# EAGLE design wendor motor (EAGLE 8.7.1)
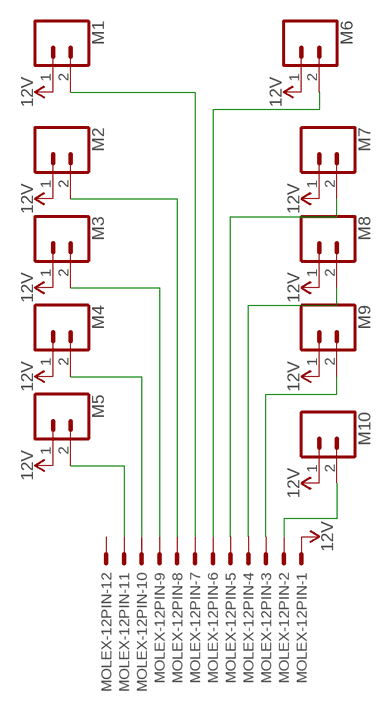
[diagram p0: schematic, sheet 1]

## Parts
M1  CONN_02  [1X02]
M2  CONN_02  [1X02]
M3  CONN_02  [1X02]
M4  CONN_02  [1X02]
M5  CONN_02  [1X02]
M6  CONN_02  [1X02]
M7  CONN_02  [1X02]
M8  CONN_02  [1X02]
M9  CONN_02  [1X02]
M10  CONN_02  [1X02]
MOLEX-12PIN  5566-12  [5566-12]

## Nets
12V: M1.1 M2.1 M3.1 M4.1 M5.1 M6.1 M7.1 M8.1 M9.1 M10.1 MOLEX-12PIN.1
N$1: M5.2 MOLEX-12PIN.11
N$2: M4.2 MOLEX-12PIN.10
N$3: M3.2 MOLEX-12PIN.9
N$4: M2.2 MOLEX-12PIN.8
N$5: M1.2 MOLEX-12PIN.7
N$6: M6.2 MOLEX-12PIN.6
N$7: M7.2 MOLEX-12PIN.5
N$8: M8.2 MOLEX-12PIN.4
N$9: M9.2 MOLEX-12PIN.3
N$10: M10.2 MOLEX-12PIN.2
Unconnected: MOLEX-12PIN.12

## Library data of the parts
M1-M10 = SparkFun-Connectors:CONN_02: Multi connection point. Often used as Generic Header-pin footprint for 0.1 inch spaced/style header connections On any of the 0.1 inch spaced packages, you can populate with these: Break Away Headers - Straight <https://www.sparkfun.com/products/116> (PRT-00116) Break Away Male Headers - Right Angle <https://www.sparkfun.com/products/553> (PRT-00553) Female Headers <https://www.sparkfun.com/products/115> (PRT-00115) Break Away Headers - Machine Pin <https://www.sparkfun.com/products/117> (PRT-00117) Break Away Female Headers - Swiss Machine Pin <https://www.sparkfun.com/products/743> (PRT-00743) For SCREWTERMINALS and SPRING TERMINALS visit here: Screw Terimnals on SparkFun.com <https://www.sparkfun.com/search/results?term=Screw+Terminals> (5mm/3.5mm/2.54mm spacing) This device is also useful as a general connection point to wire up your design to another part of your project. Our various solder wires solder well into these plated through hole pads. Hook-Up Wire - Assortment (Stranded, 22 AWG) <https://www.sparkfun.com/products/11375> (PRT-11375) Hook-Up Wire - Assortment (Solid Core, 22 AWG) <https://www.sparkfun.com/products/11367> (PRT-11367) View the entire wire category on our website here <https://www.sparkfun.com/categories/141> Special notes: Molex polarized connector foot print use with: PRT-08233 with associated crimp pins and housings. 2.54_SCREWTERM for use with PRT-10571. 3.5mm Screw Terminal footprints for PRT-08084 5mm Screw Terminal footprints for use with PRT-08432
MOLEX-12PIN = con-molex:5566-12: Mini FIT connector 12 pol Source: http://www.molex.com; MF: MOLEX; OC_FARNELL: unknown; OC_NEWARK: unknown

## Board
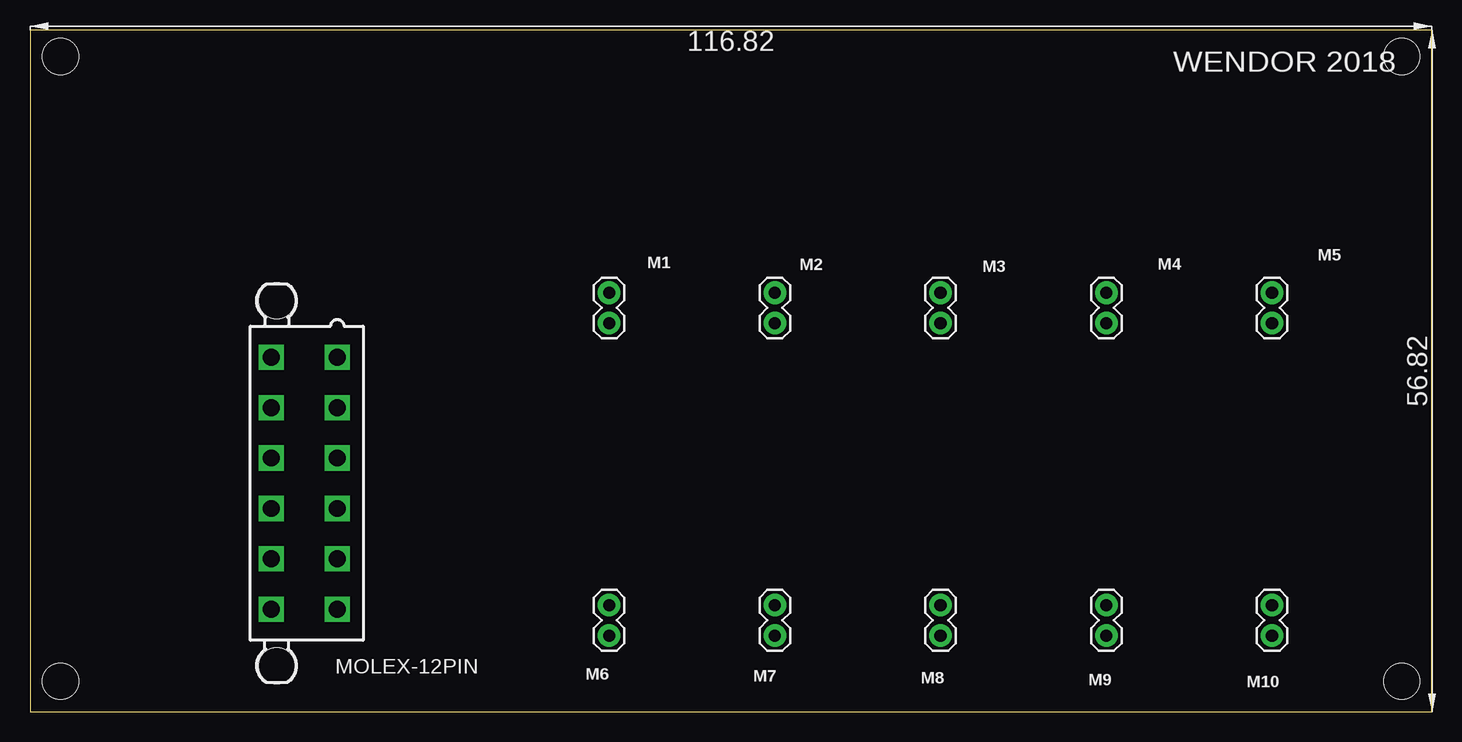
[diagram p1: board, top side]
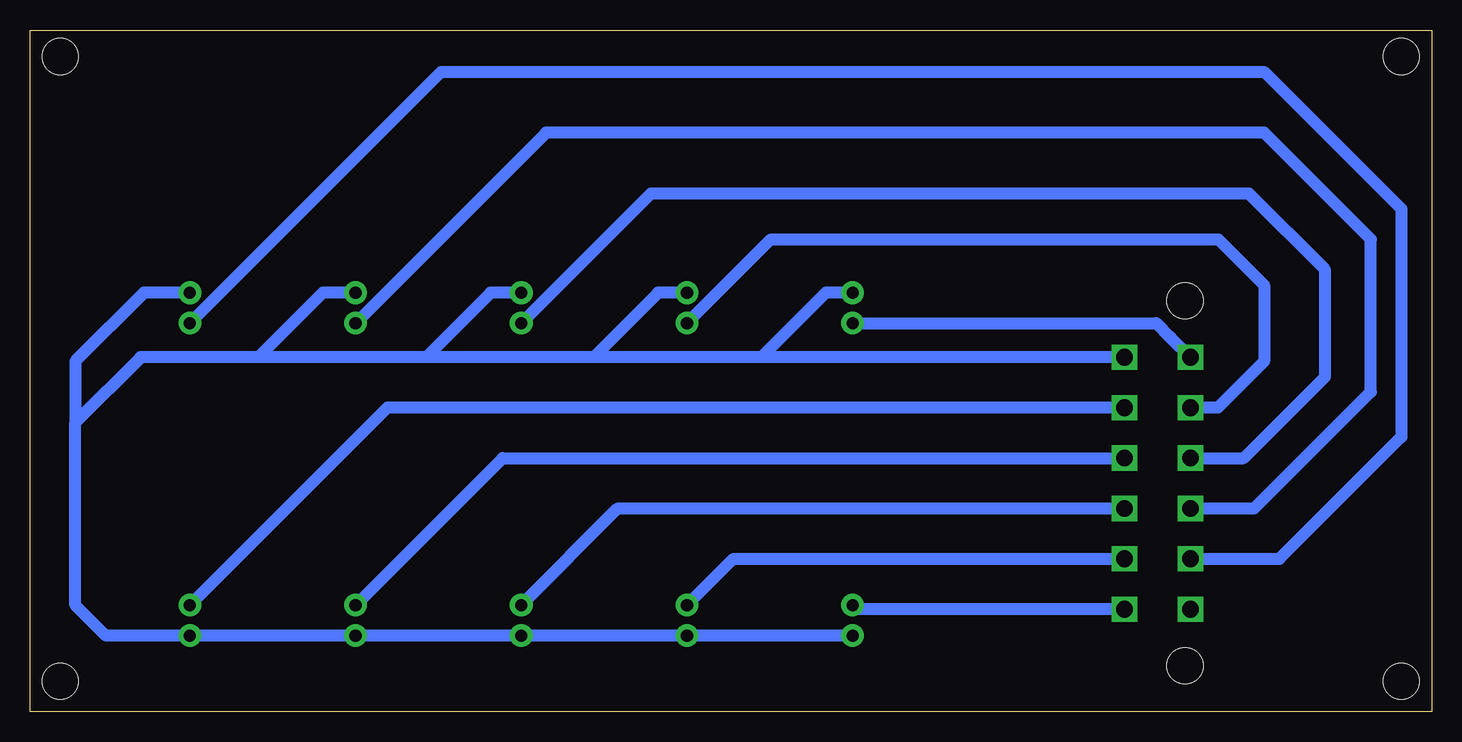
[diagram p2: board, bottom side, seen from below]

Size 116.82 x 56.82 mm. Coordinates in mm from the lower left corner, seen from the top.
Outline: 0,0 116.82,0 116.82,56.82 0,56.82 0,0
Copper layers (1*16): Top 0.035mm / dielectric 1.5mm / Bottom 0.035mm
Design rules "default *": minimum track width 40mil, minimum drill 0.35mm, track to track 20mil, track to pad 6mil, pad to pad 6mil, via to via 6mil, smd to smd 6mil, copper to edge 40mil, drill to drill 6mil, minimum pad ring 10mil, minimum via ring 8mil, stop-mask expansion 4mil, vias tented up to drill 0mil, thermal gap 10mil
Holes 3 mm at 2.54,54.61 2.54,2.54 114.3,54.61 114.3,2.54

### Footprints (pad centres in the part's own frame; a part is rotated, then mirrored left to right if it is on the bottom)
1X02 = drill 1.016 pad 1.88: 1 0,0; 2 2.54,0
5566-12 = drill 1.4 square: 1 10.5,-2.75; 2 6.3,-2.75; 3 2.1,-2.75; 4 -2.1,-2.75; 5 -6.3,-2.75; 6 -10.5,-2.75; 7 10.5,2.75; 8 6.3,2.75; 9 2.1,2.75; 10 -2.1,2.75; 11 -6.3,2.75; 12 -10.5,2.75 | hole 3: 15.2,2.29; -15.2,2.29

### Placement (x,y rotation side)
M1  48.26,34.93 270 top
M2  62.07,34.93 270 top
M3  75.88,34.93 270 top
M4  89.69,34.93 270 top
M5  103.51,34.93 270 top
M6  48.26,6.35 90 top
M7  62.07,6.35 90 top
M8  75.88,6.35 90 top
M9  89.69,6.35 90 top
M10  103.51,6.35 90 top
MOLEX-12PIN  22.86,19.05 90 top

### Tracks (layer width: path | path; a pad name or v marks a point on that pad's centre or on a via)
12V
  Bottom 1.016: 113.03,24.13 113.03,8.89 110.49,6.35 M10.1 M9.1 M8.1 M7.1 M6.1 | 113.03,24.13 107.61,29.55 97.79,29.55 | MOLEX-12PIN.1 55.88,29.55 | 55.88,29.55 69.85,29.55 | 69.85,29.55 83.82,29.55 | 83.82,29.55 97.79,29.55 | M5.1 107.31,34.93 113.03,29.21 113.03,24.13 | M4.1 92.42,34.93 97.79,29.55 | M3.1 78.45,34.93 83.82,29.55 | M2.1 64.48,34.93 69.85,29.55 | M1.1 50.5,34.93 55.88,29.55
N$1
  Bottom 1.016: M5.2 82.55,53.34 13.97,53.34 2.54,41.91 2.54,22.91 12.7,12.75 MOLEX-12PIN.11
N$2
  Bottom 1.016: MOLEX-12PIN.10 14.8,16.95 5.08,26.67 5.08,39.37 13.97,48.26 73.82,48.26 M4.2
N$3
  Bottom 1.016: MOLEX-12PIN.9 15.68,21.15 8.89,27.94 8.89,36.83 15.24,43.18 65.09,43.18 M3.2
N$4
  Bottom 1.016: M2.2 55.09,39.37 17.78,39.37 13.97,35.56 13.97,29.21 17.83,25.35 MOLEX-12PIN.8
N$5
  Bottom 1.016: M1.2 22.98,32.38 21.82,31.23 21.79,31.23 MOLEX-12PIN.7
N$6
  Bottom 1.016: MOLEX-12PIN.6 47.92,8.55 M6.2
N$7
  Bottom 1.016: M7.2 58.21,12.75 MOLEX-12PIN.5
N$8
  Bottom 1.016: M8.2 67.82,16.95 MOLEX-12PIN.4
N$9
  Bottom 1.016: M9.2 77.43,21.15 MOLEX-12PIN.3
N$10
  Bottom 1.016: MOLEX-12PIN.2 87.05,25.35 M10.2

### Text on the board
tNames: WENDOR 2018